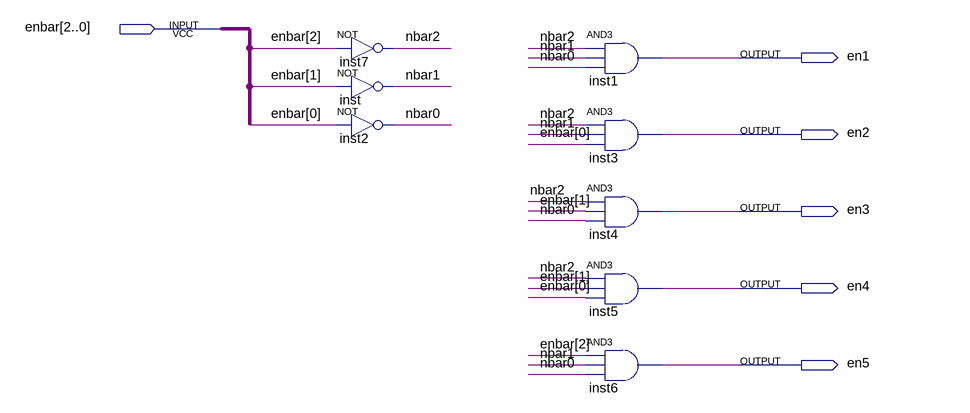
[diagram p0: schematic sheet]
// Quartus schematic decoderULARegs.bdf as structural Verilog: 8 symbols, 6 pins
module decoderULARegs (
  input  [2:0] enbar,
  output en1,
  output en2,
  output en3,
  output en4,
  output en5
);

  wire nbar0, nbar1, nbar2;

  not inst7 (nbar2, enbar[2]);
  not inst (nbar1, enbar[1]);
  not inst2 (nbar0, enbar[0]);
  and inst1 (en1, nbar2, nbar1, nbar0);
  and inst3 (en2, nbar2, nbar1, enbar[0]);
  and inst4 (en3, nbar2, enbar[1], nbar0);
  and inst5 (en4, nbar2, enbar[1], enbar[0]);
  and inst6 (en5, enbar[2], nbar1, nbar0);
endmodule
